# EAGLE design BATT_INPUT_TEST_BED_v3 (EAGLE 9.6.2)
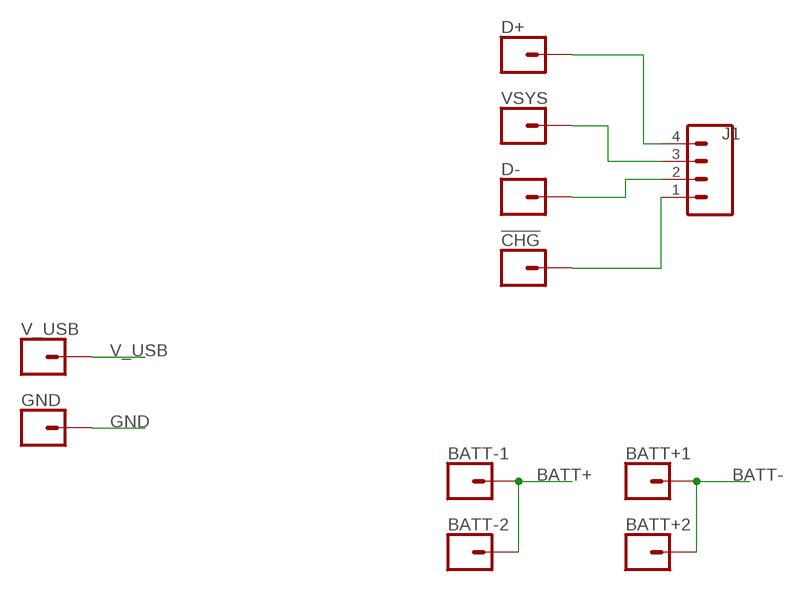
[diagram p0: schematic, sheet 1]

## Parts
!CHG!  CONN_01POGOPIN_HOLE_LARGE  [1X01_POGOPIN_HOLE_0.061_DIA]
BATT+1  CONN_01POGOPIN_HOLE_LARGE  [1X01_POGOPIN_HOLE_0.061_DIA]
BATT+2  CONN_01POGOPIN_HOLE_LARGE  [1X01_POGOPIN_HOLE_0.061_DIA]
BATT-1  CONN_01POGOPIN_HOLE_LARGE  [1X01_POGOPIN_HOLE_0.061_DIA]
BATT-2  CONN_01POGOPIN_HOLE_LARGE  [1X01_POGOPIN_HOLE_0.061_DIA]
D+  CONN_01POGOPIN_HOLE_LARGE  [1X01_POGOPIN_HOLE_0.061_DIA]
D-  CONN_01POGOPIN_HOLE_LARGE  [1X01_POGOPIN_HOLE_0.061_DIA]
GND  CONN_01POGOPIN_HOLE_LARGE  [1X01_POGOPIN_HOLE_0.061_DIA]
J1  FEMALE 2x3  CONN_04  [1X04]
V_USB  CONN_01POGOPIN_HOLE_LARGE  [1X01_POGOPIN_HOLE_0.061_DIA]
VSYS  CONN_01POGOPIN_HOLE_LARGE  [1X01_POGOPIN_HOLE_0.061_DIA]

## Nets
BATT+: BATT-1.2 BATT-2.2
BATT-: BATT+1.2 BATT+2.2
GND: GND.2
N$1: J1.3 VSYS.2
N$2: D+.2 J1.4
N$3: !CHG!.2 J1.1
N$4: D-.2 J1.2
V_USB: V_USB.2

## Library data of the parts
!CHG! BATT+1 BATT+2 BATT-1 BATT-2 D+ D- GND V_USB VSYS = SparkFun-Connectors:CONN_01: Single connection point. Often used as Generic Header-pin footprint for 0.1 inch spaced/style header connections On any of the 0.1 inch spaced packages, you can populate with these: Break Away Headers - Straight <https://www.sparkfun.com/products/116> (PRT-00116) Break Away Male Headers - Right Angle <https://www.sparkfun.com/products/553> (PRT-00553) Female Headers <https://www.sparkfun.com/products/115> (PRT-00115) Break Away Headers - Machine Pin <https://www.sparkfun.com/products/117> (PRT-00117) Break Away Female Headers - Swiss Machine Pin <https://www.sparkfun.com/products/743> (PRT-00743) This device is also useful as a general connection point to wire up your design to another part of your project. Our various solder wires solder well into these plated through hole pads. Hook-Up Wire - Assortment (Stranded, 22 AWG) <https://www.sparkfun.com/products/11375> (PRT-11375) Hook-Up Wire - Assortment (Solid Core, 22 AWG) <https://www.sparkfun.com/products/11367> (PRT-11367) View the entire wire category on our website here <https://www.sparkfun.com/categories/141> Special notes: SMTSO-256-ET is a "flush mount" nut for a 4-40 screw. We mostly use this on specialty testbeds; it is a nice way to connect hardware to your PCB at an adjustable hieght. Also note, the SNAP packages are for using a snappable style connector. We sell a baggie of snaps and they are also used on two LilyPad designs: Snap Assortment - 30 pack (male and female) <https://www.sparkfun.com/products/11347> (DEV-11347) LilyPad Arduino SimpleSnap <https://www.sparkfun.com/products/10941> (DEV-10941) LilyPad SimpleSnap Protoboard <https://www.sparkfun.com/products/10940> (DEV-10940)
J1 = SparkFun-Connectors:CONN_04: Multi connection point. Often used as Generic Header-pin footprint for 0.1 inch spaced/style header connections On any of the 0.1 inch spaced packages, you can populate with these: Break Away Headers - Straight <https://www.sparkfun.com/products/116> (PRT-00116) Break Away Male Headers - Right Angle <https://www.sparkfun.com/products/553> (PRT-00553) Female Headers <https://www.sparkfun.com/products/115> (PRT-00115) Break Away Headers - Machine Pin <https://www.sparkfun.com/products/117> (PRT-00117) Break Away Female Headers - Swiss Machine Pin <https://www.sparkfun.com/products/743> (PRT-00743) For SCREWTERMINALS and SPRING TERMINALS visit here: Screw Terimnals on SparkFun.com <https://www.sparkfun.com/search/results?term=Screw+Terminals> (5mm/3.5mm/2.54mm spacing) This device is also useful as a general connection point to wire up your design to another part of your project. Our various solder wires solder well into these plated through hole pads. Hook-Up Wire - Assortment (Stranded, 22 AWG) <https://www.sparkfun.com/products/11375> (PRT-11375) Hook-Up Wire - Assortment (Solid Core, 22 AWG) <https://www.sparkfun.com/products/11367> (PRT-11367) View the entire wire category on our website here <https://www.sparkfun.com/categories/141> Special notes: Molex polarized connector foot print use with SKU : PRT-08231 with associated crimp pins and housings. 1MM SMD Version SKU: PRT-10208; PROD_ID: CONN-09696

## Net classes
1 power: width 0.178 mm
2 gnd: width 0.305 mm, drill 0.483 mm, clearance 0.203 mm

## Board
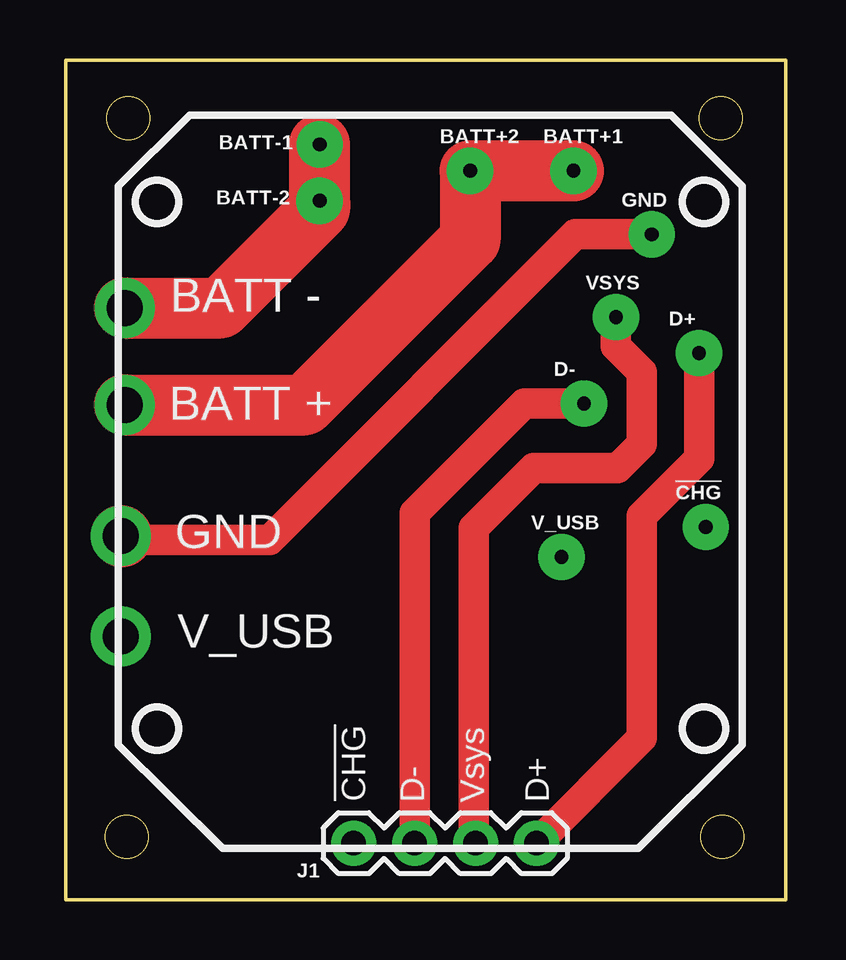
[diagram p1: board, top side]
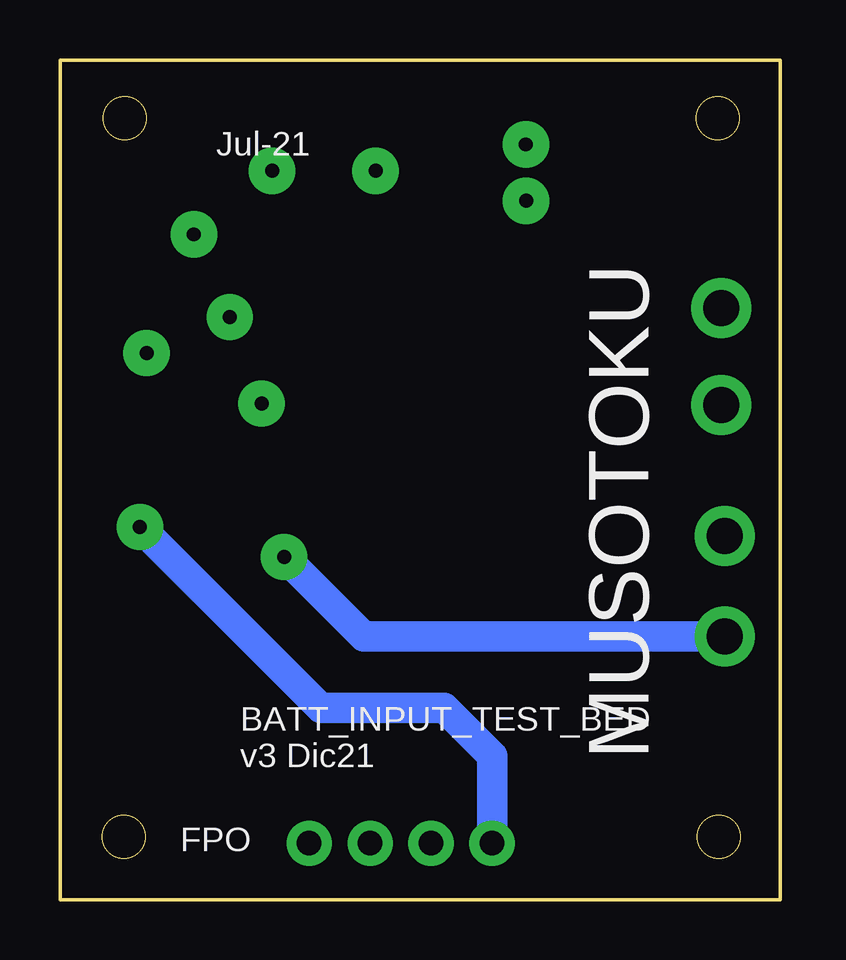
[diagram p2: board, bottom side, seen from below]

Size 30 x 35 mm. Coordinates in mm from the lower left corner, seen from the top.
Outline: 0,35 30,35 30,0 0,0 0,35
Outline: circle at 2.55,2.62 radius 0.9
Outline: circle at 27.35,2.62 radius 0.9
Outline: circle at 2.6,32.58 radius 0.9
Outline: circle at 27.3,32.58 radius 0.9
Copper layers (1*16): Top 0.035mm / dielectric 1.5mm / Bottom 0.035mm
Design rules "default *": minimum track width 6mil, minimum drill 0.3mm, track to track 6mil, track to pad 6mil, pad to pad 6mil, via to via 8mil, smd to smd 6mil, copper to edge 10mil, drill to drill 10mil, minimum pad ring 10mil, minimum via ring 8mil, stop-mask expansion 4mil, vias tented up to drill 50mil, thermal gap 10mil

### Footprints (pad centres in the part's own frame; a part is rotated, then mirrored left to right if it is on the bottom)
1X01_POGOPIN_HOLE_0.061_DIA = drill 0.58 pad 1.93: 2 0,0
1X04 = drill 1.016 pad 1.88: 1 0,0; 2 2.54,0; 3 5.08,0; 4 7.62,0

### Placement (x,y rotation side)
!CHG!  26.67,15.53 0 top
BATT+1  21.16,30.38 0 top
BATT+2  16.85,30.38 0 top
BATT-1  10.59,31.48 0 top
BATT-2  10.58,29.13 0 top
D+  26.39,22.78 0 top
D-  21.6,20.68 0 top
GND  24.42,27.73 0 top
J1  12,2.35 0 top
V_USB  20.66,14.28 0 top
VSYS  22.93,24.28 0 top

### Tracks (layer width: path | path; a pad name or v marks a point on that pad's centre or on a via)
BATT+  (via drill 1.5 pad 2.5)
  Top 1.016: BATT-1.2
  Top 2.54: v2.45,24.66 6.45,24.66 10.58,28.79 BATT-2.2 BATT-1.2
BATT-  (via drill 1.5 pad 2.5)
  Top 2.54: v2.45,20.62 9.95,20.62 16.85,27.51 BATT+2.2 BATT+1.2
GND  (via drill 1.5 pad 2.5)
  Top 1.27: GND.2 21.23,27.73 8.5,15 2.47,15 2.34,15.13
  Top 2.54: 2.34,15.13 v2.3,15.16
N$1
  Top 1.27: VSYS.2 22.93,23.07 24,22 24,19 23,18 19.5,18 17,15.5 17,2.43 J1.3
N$2
  Top 1.27: D+.2 26.39,18.39 24,16 24,6.73 J1.4
N$3
  Bottom 1.27: !CHG!.2 19.14,8 14,8 12,6 J1.1
N$4
  Top 1.27: D-.2 19.1,20.68 14.54,16.12 J1.2
V_USB  (via drill 1.5 pad 2.5)
  Bottom 1.27: V_USB.2 17.34,10.97 v2.3,10.97

### Text on the board
tNames: BATT - | BATT + | GND | V_USB | !CHG! | D- | Vsys | D+
bNames: Jul-21 | MUSOTOKU | BATT_INPUT_TEST_BED / v3 Dic21 | FPO